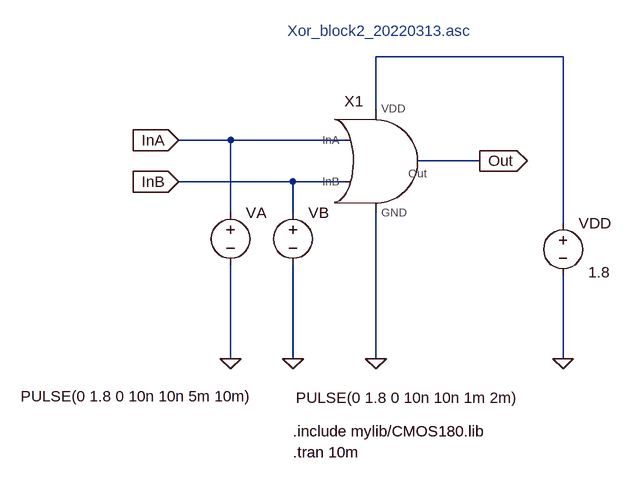
[diagram p0: schematic Xor_block2_20220313.asc]
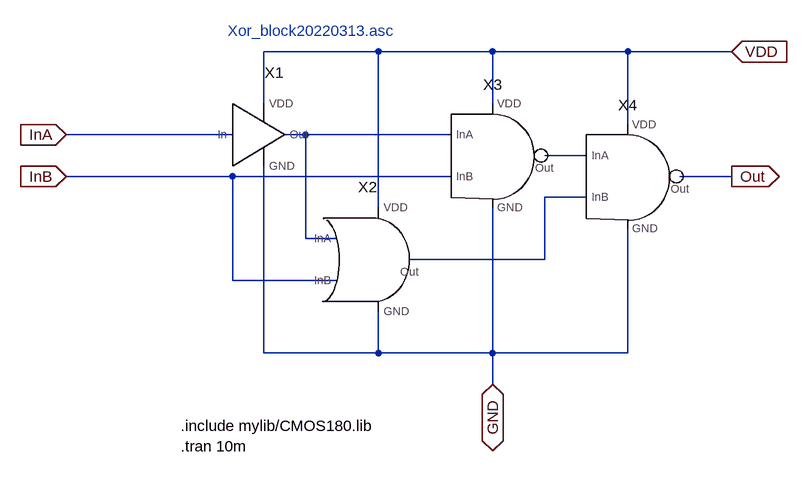
[diagram p1: sub-circuit xor_block_20220313.asc]
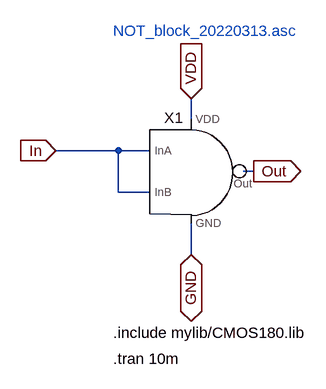
[diagram p2: sub-circuit not_block_20220313.asc]
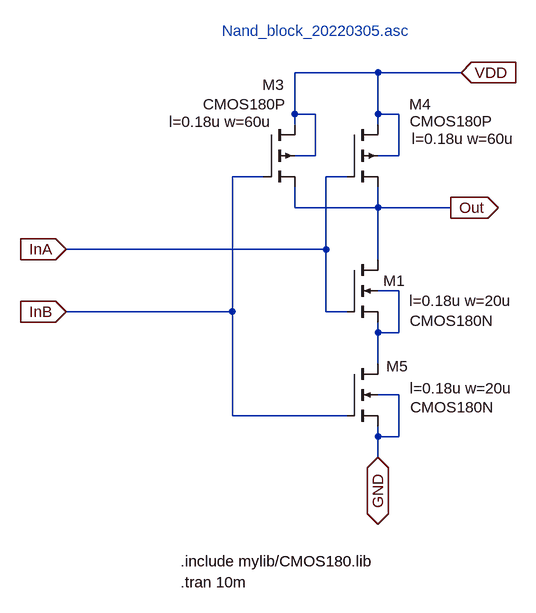
[diagram p3: sub-circuit nand_block_20220305.asc]
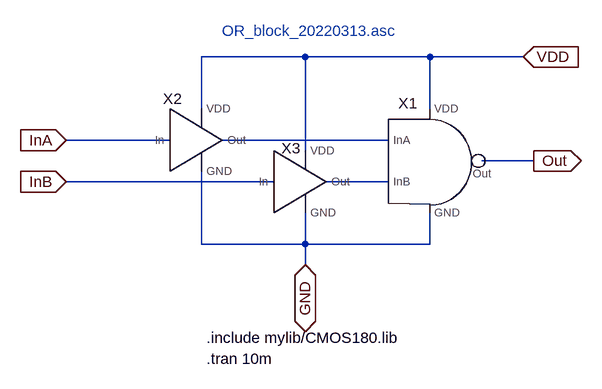
[diagram p4: sub-circuit or_block_20220313.asc]
Xor_block2_20220313.asc, the LTspice schematic file:
Version 4
SHEET 1 1036 680
WIRE 336 -96 48 -96
WIRE 48 -16 48 -96
WIRE -176 32 -256 32
WIRE 0 32 -176 32
WIRE 208 64 112 64
WIRE -80 96 -256 96
WIRE 0 96 -80 96
WIRE -176 144 -176 32
WIRE -80 144 -80 96
WIRE 336 160 336 -96
WIRE -176 368 -176 224
WIRE -80 368 -80 224
WIRE 48 368 48 144
WIRE 336 368 336 240
FLAG 208 64 Out
IOPIN 208 64 Out
FLAG -256 32 InA
IOPIN -256 32 In
FLAG -256 96 InB
IOPIN -256 96 In
FLAG 336 368 0
FLAG -176 368 0
FLAG -80 368 0
FLAG 48 368 0
SYMBOL voltage 336 144 R0
WINDOW 3 39 91 Left 2
WINDOW 123 0 0 Left 0
WINDOW 39 0 0 Left 0
SYMATTR Value 1.8
SYMATTR InstName VDD
SYMBOL voltage -176 128 R0
WINDOW 3 -323 298 Left 2
WINDOW 123 0 0 Left 0
WINDOW 39 0 0 Left 0
SYMATTR Value PULSE(0 1.8 0 10n 10n 5m 10m)
SYMATTR InstName VA
SYMBOL voltage -80 128 R0
WINDOW 3 5 300 Left 2
WINDOW 123 0 0 Left 0
WINDOW 39 0 0 Left 0
SYMATTR Value PULSE(0 1.8 0 10n 10n 1m 2m)
SYMATTR InstName VB
SYMBOL Xor_block_20220313 48 64 R0
WINDOW 0 -34 -76 Bottom 2
SYMATTR InstName X1
TEXT -80 480 Left 2 !.include mylib/CMOS180.lib
TEXT -88 -136 Left 2 ;Xor_block2_20220313.asc
TEXT -80 512 Left 2 !.tran 10m

xor_block_20220313.asc, the sub-circuit schematic file:
Version 4
SHEET 1 1036 680
WIRE 224 -96 48 -96
WIRE 400 -96 224 -96
WIRE 608 -96 400 -96
WIRE 768 -96 608 -96
WIRE 48 -16 48 -96
WIRE 400 -16 400 -96
WIRE 608 16 608 -96
WIRE 0 32 -256 32
WIRE 112 32 80 32
WIRE 336 32 112 32
WIRE 544 64 480 64
WIRE 0 96 -256 96
WIRE 336 96 0 96
WIRE 768 96 688 96
WIRE 544 128 480 128
WIRE 224 144 224 -96
WIRE 112 192 112 32
WIRE 160 192 112 192
WIRE 480 224 480 128
WIRE 480 224 272 224
WIRE 0 256 0 96
WIRE 160 256 0 256
WIRE 48 368 48 80
WIRE 224 368 224 304
WIRE 224 368 48 368
WIRE 400 368 400 144
WIRE 400 368 224 368
WIRE 608 368 608 176
WIRE 608 368 400 368
WIRE 400 416 400 368
FLAG 768 96 Out
IOPIN 768 96 Out
FLAG -256 32 InA
IOPIN -256 32 In
FLAG -256 96 InB
IOPIN -256 96 In
FLAG 400 416 GND
IOPIN 400 416 BiDir
FLAG 768 -96 VDD
IOPIN 768 -96 In
SYMBOL NOT_block_20220313 64 32 R0
SYMATTR InstName X1
SYMBOL OR_block_20220313 208 224 R0
SYMATTR InstName X2
SYMBOL Nand_block_20220305 400 80 R0
SYMATTR InstName X3
SYMBOL Nand_block_20220305 608 112 R0
SYMATTR InstName X4
TEXT -80 480 Left 2 !.include mylib/CMOS180.lib
TEXT -8 -128 Left 2 ;Xor_block20220313.asc
TEXT -80 512 Left 2 !.tran 10m

not_block_20220313.asc, the sub-circuit schematic file:
Version 4
SHEET 1 1036 680
WIRE 112 -48 112 -80
WIRE 0 0 -96 0
WIRE 48 0 0 0
WIRE 208 32 192 32
WIRE 0 64 0 0
WIRE 48 64 0 64
WIRE 112 160 112 112
FLAG 208 32 Out
IOPIN 208 32 Out
FLAG -96 0 In
IOPIN -96 0 In
FLAG 112 160 GND
IOPIN 112 160 BiDir
FLAG 112 -80 VDD
IOPIN 112 -80 In
SYMBOL Nand_block_20220305 112 48 R0
WINDOW 0 -27 -83 Bottom 2
SYMATTR InstName X1
TEXT -8 280 Left 2 !.include mylib/CMOS180.lib
TEXT -8 -184 Left 2 ;NOT_block_20220313.asc
TEXT -8 320 Left 2 !.tran 10m

nand_block_20220305.asc, the sub-circuit schematic file:
Version 4
SHEET 1 1036 680
WIRE 224 -272 96 -272
WIRE 352 -272 224 -272
WIRE 96 -208 96 -272
WIRE 128 -208 96 -208
WIRE 224 -208 224 -272
WIRE 256 -208 224 -208
WIRE 96 -192 96 -208
WIRE 224 -192 224 -208
WIRE 128 -144 128 -208
WIRE 128 -144 96 -144
WIRE 256 -144 256 -208
WIRE 256 -144 224 -144
WIRE 48 -112 0 -112
WIRE 176 -112 144 -112
WIRE 96 -64 96 -96
WIRE 224 -64 224 -96
WIRE 224 -64 96 -64
WIRE 336 -64 224 -64
WIRE 144 0 144 -112
WIRE 144 0 -256 0
WIRE 224 16 224 -64
WIRE 256 64 224 64
WIRE 0 96 0 -112
WIRE 0 96 -256 96
WIRE 144 96 144 0
WIRE 176 96 144 96
WIRE 224 128 224 112
WIRE 256 128 256 64
WIRE 256 128 224 128
WIRE 224 176 224 128
WIRE 256 224 224 224
WIRE 0 256 0 96
WIRE 176 256 0 256
WIRE 224 288 224 272
WIRE 256 288 256 224
WIRE 256 288 224 288
WIRE 224 320 224 288
FLAG 336 -64 Out
IOPIN 336 -64 Out
FLAG -256 0 InA
IOPIN -256 0 In
FLAG -256 96 InB
IOPIN -256 96 In
FLAG 224 320 GND
IOPIN 224 320 BiDir
FLAG 352 -272 VDD
IOPIN 352 -272 In
SYMBOL nmos4 176 16 R0
WINDOW 123 96 63 Left 2
WINDOW 3 97 94 Left 2
SYMATTR Value2 l=0.18u w=20u
SYMATTR Value CMOS180N
SYMATTR InstName M1
SYMBOL pmos4 48 -192 R0
WINDOW 0 -2 -61 Left 2
WINDOW 3 -93 -31 Left 2
WINDOW 123 -146 -4 Left 2
SYMATTR InstName M3
SYMATTR Value CMOS180P
SYMATTR Value2 l=0.18u w=60u
SYMBOL pmos4 176 -192 R0
WINDOW 0 96 -31 Left 2
WINDOW 3 97 -5 Left 2
WINDOW 123 100 22 Left 2
SYMATTR InstName M4
SYMATTR Value CMOS180P
SYMATTR Value2 l=0.18u w=60u
SYMBOL nmos4 176 176 R0
WINDOW 123 97 38 Left 2
WINDOW 0 61 4 Left 2
WINDOW 3 98 67 Left 2
SYMATTR Value2 l=0.18u w=20u
SYMATTR InstName M5
SYMATTR Value CMOS180N
TEXT -80 480 Left 2 !.include mylib/CMOS180.lib
TEXT -16 -336 Left 2 ;Nand_block_20220305.asc
TEXT -80 512 Left 2 !.tran 10m

or_block_20220313.asc, the sub-circuit schematic file:
Version 4
SHEET 1 1036 680
WIRE 112 -96 -48 -96
WIRE 304 -96 112 -96
WIRE 448 -96 304 -96
WIRE -48 -16 -48 -96
WIRE 304 -16 304 -96
WIRE -96 32 -256 32
WIRE 240 32 -16 32
WIRE 112 48 112 -96
WIRE 464 64 384 64
WIRE 64 96 -256 96
WIRE 240 96 144 96
WIRE -48 192 -48 80
WIRE 112 192 112 144
WIRE 112 192 -48 192
WIRE 304 192 304 144
WIRE 304 192 112 192
WIRE 112 224 112 192
FLAG 464 64 Out
IOPIN 464 64 Out
FLAG -256 32 InA
IOPIN -256 32 In
FLAG -256 96 InB
IOPIN -256 96 In
FLAG 112 224 GND
IOPIN 112 224 BiDir
FLAG 448 -96 VDD
IOPIN 448 -96 In
SYMBOL Nand_block_20220305 304 80 R0
WINDOW 0 -34 -89 Bottom 2
SYMATTR InstName X1
SYMBOL NOT_block_20220313 -32 32 R0
WINDOW 0 -60 -48 Bottom 2
SYMATTR InstName X2
SYMBOL NOT_block_20220313 128 96 R0
WINDOW 0 -38 -36 Bottom 2
SYMATTR InstName X3
TEXT -40 336 Left 2 !.include mylib/CMOS180.lib
TEXT -16 -136 Left 2 ;OR_block_20220313.asc
TEXT -40 368 Left 2 !.tran 10m

The netlist it stands for:
* Xor_block2_20220313.asc
VDD N001 0 1.8
VA InA 0 PULSE(0 1.8 0 10n 10n 5m 10m)
VB InB 0 PULSE(0 1.8 0 10n 10n 1m 2m)
XX1 InA InB N001 0 Out xor_block_20220313

* block symbol definitions
.subckt xor_block_20220313 InA InB VDD GND Out
XX1 InA VDD GND N001 not_block_20220313
XX2 N001 InB VDD GND N003 or_block_20220313
XX3 N001 InB VDD GND N002 nand_block_20220305
XX4 N002 N003 VDD GND Out nand_block_20220305
.include mylib/CMOS180.lib
* Xor_block20220313.asc
.tran 10m
.ends xor_block_20220313

.subckt not_block_20220313 In VDD GND Out
XX1 In In VDD GND Out nand_block_20220305
.include mylib/CMOS180.lib
* NOT_block_20220313.asc
.tran 10m
.ends not_block_20220313

.subckt nand_block_20220305 InA InB VDD GND Out
M1 Out InA N001 N001 CMOS180N l=0.18u w=20u
M3 VDD InB Out VDD CMOS180P l=0.18u w=60u
M4 VDD InA Out VDD CMOS180P l=0.18u w=60u
M5 N001 InB GND GND CMOS180N l=0.18u w=20u
.include mylib/CMOS180.lib
* Nand_block_20220305.asc
.tran 10m
.ends nand_block_20220305

.subckt or_block_20220313 InA InB VDD GND Out
XX1 N001 N002 VDD GND Out nand_block_20220305
XX2 InA VDD GND N001 not_block_20220313
XX3 InB VDD GND N002 not_block_20220313
.include mylib/CMOS180.lib
* OR_block_20220313.asc
.tran 10m
.ends or_block_20220313

.model NMOS NMOS
.model PMOS PMOS
.lib standard.mos
.include mylib/CMOS180.lib
* Xor_block2_20220313.asc
.tran 10m
.backanno
.end